# EAGLE schematic leddriver (EAGLE 9.3.2)
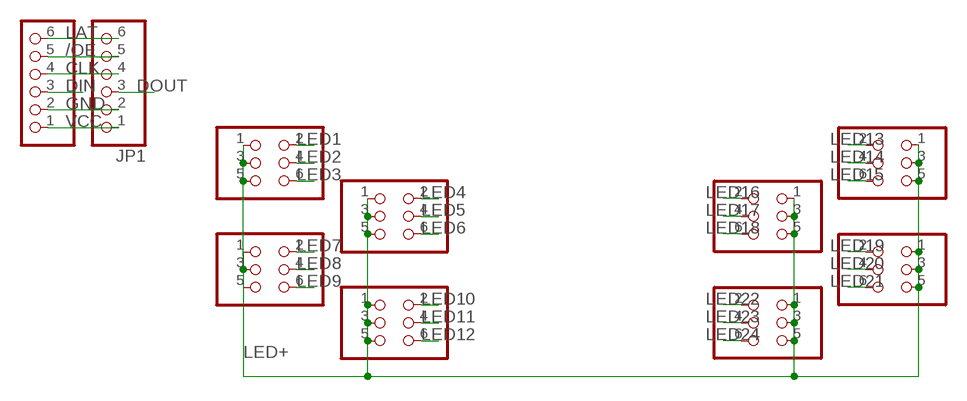
[diagram p0: schematic, sheet 1]

## Parts
JP1  INPUT  PINHD-1X6CB  [1X06-CLEANBIG]
JP2  HEADER-2X3  [2X03_ROUND_70MIL]
JP3  HEADER-2X3  [2X03_ROUND_70MIL]
JP4  HEADER-2X3  [2X03_ROUND_70MIL]
JP5  HEADER-2X3  [2X03_ROUND_70MIL]
JP6  HEADER-2X3  [2X03_ROUND_70MIL]
JP7  HEADER-2X3  [2X03_ROUND_70MIL]
JP8  HEADER-2X3  [2X03_ROUND_70MIL]
JP9  HEADER-2X3  [2X03_ROUND_70MIL]
JP10  OUTPUT  PINHD-1X6CB  [1X06-CLEANBIG]

## Nets
/OE: JP1.5 JP10.5
CLK: JP1.4 JP10.4
DIN: JP10.3
DOUT: JP1.3
GND: JP1.2 JP10.2
LAT: JP1.6 JP10.6
LED1: JP2.2
LED2: JP2.4
LED3: JP2.6
LED4: JP3.2
LED5: JP3.4
LED6: JP3.6
LED7: JP4.2
LED8: JP4.4
LED9: JP4.6
LED10: JP5.2
LED11: JP5.4
LED12: JP5.6
LED13: JP6.2
LED14: JP6.4
LED15: JP6.6
LED16: JP7.2
LED17: JP7.4
LED18: JP7.6
LED19: JP8.2
LED20: JP8.4
LED21: JP8.6
LED22: JP9.2
LED23: JP9.4
LED24: JP9.6
LED+: JP2.1 JP2.3 JP2.5 JP3.1 JP3.3 JP3.5 JP4.1 JP4.3 JP4.5 JP5.1 JP5.3 JP5.5 JP6.1 JP6.3 JP6.5 JP7.1 JP7.3 JP7.5 JP8.1 JP8.3 JP8.5 JP9.1 JP9.3 JP9.5
VCC: JP1.1 JP10.1

## Library data of the parts
JP1 JP10 = adafruit:PINHD-1X6: PIN HEADER; MPN: 1016; OC_NEWARK: 31Y5676
JP2-JP9 = microbuilder:HEADER-2X3: PIN HEADER; OC_NEWARK: unknown

## Net classes
0 everything: width 0.254 mm